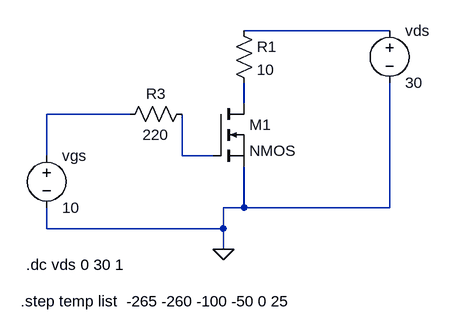
[diagram p0: schematic Cryo Cmos characteristics.asc]
Cryo Cmos characteristics.asc, the LTspice schematic file:
Version 4.1
SHEET 1 880 680
WIRE 416 32 192 32
WIRE 192 144 192 112
WIRE 16 160 -112 160
WIRE -112 224 -112 160
WIRE 96 224 96 160
WIRE 144 224 96 224
WIRE 192 304 192 240
WIRE 192 304 160 304
WIRE 416 304 416 112
WIRE 416 304 192 304
WIRE -112 336 -112 304
WIRE 160 336 160 304
WIRE 160 336 -112 336
WIRE 160 368 160 336
FLAG 160 368 0
SYMBOL nmos 144 144 R0
SYMATTR InstName M1
SYMBOL res 176 16 R0
SYMATTR InstName R1
SYMATTR Value 10
SYMBOL voltage -112 208 R0
WINDOW 123 0 0 Left 0
WINDOW 39 0 0 Left 0
SYMATTR InstName vgs
SYMATTR Value 10
SYMBOL voltage 416 16 R0
WINDOW 123 0 0 Left 0
WINDOW 39 0 0 Left 0
SYMATTR InstName vds
SYMATTR Value 30
SYMBOL res 112 144 R90
WINDOW 0 0 56 VBottom 2
WINDOW 3 32 56 VTop 2
SYMATTR InstName R3
SYMATTR Value 220
TEXT -144 392 Left 2 !.dc vds 0 30 1
TEXT -152 448 Left 2 !.step temp list  -265 -260 -100 -50 0 25

The netlist it stands for:
* Cryo Cmos characteristics.asc
M1 N002 N004 0 0 NMOS
R1 N001 N002 10
vgs N003 0 10
vds N001 0 30
R3 N004 N003 220
.model NMOS NMOS
.model PMOS PMOS
.lib standard.mos
.dc vds 0 30 1
.step temp list  -265 -260 -100 -50 0 25
.backanno
.end